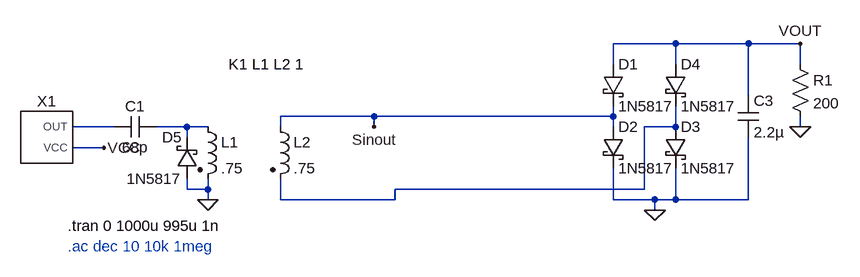
[diagram p0: schematic WPT.asc]
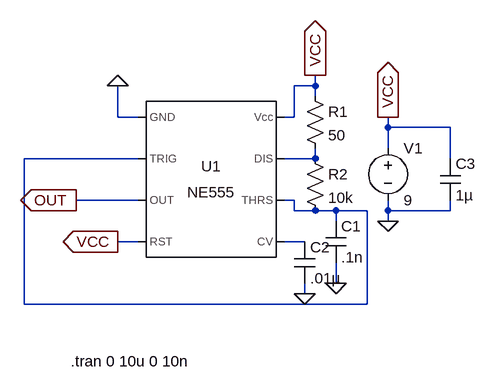
[diagram p1: sub-circuit 555timer.asc]
WPT.asc, the LTspice schematic file:
Version 4
SHEET 1 1428 680
WIRE 1008 0 912 0
WIRE 1120 0 1008 0
WIRE 1200 0 1120 0
WIRE 912 32 912 0
WIRE 1008 32 1008 0
WIRE 1200 32 1200 0
WIRE 1120 80 1120 0
WIRE 544 112 400 112
WIRE 912 112 912 96
WIRE 912 112 544 112
WIRE 144 128 80 128
WIRE 256 128 208 128
WIRE 288 128 256 128
WIRE 400 128 400 112
WIRE 544 128 544 112
WIRE 912 128 912 112
WIRE 1008 128 1008 96
WIRE 1008 128 960 128
WIRE 1200 128 1200 112
WIRE 256 144 256 128
WIRE 128 160 80 160
WIRE 256 224 256 208
WIRE 288 224 288 208
WIRE 288 224 256 224
WIRE 960 224 960 128
WIRE 960 224 576 224
WIRE 288 240 288 224
WIRE 400 240 400 208
WIRE 576 240 576 224
WIRE 576 240 400 240
WIRE 912 240 912 192
WIRE 976 240 912 240
WIRE 1008 240 1008 192
WIRE 1008 240 976 240
WIRE 1120 240 1120 144
WIRE 1120 240 1008 240
WIRE 976 256 976 240
FLAG 128 160 VCC
FLAG 288 240 0
FLAG 976 256 0
FLAG 1200 0 VOUT
FLAG 1200 128 0
FLAG 544 128 Sinout
SYMBOL 555Timer 32 144 R0
SYMATTR InstName X1
SYMBOL ind2 272 112 R0
SYMATTR InstName L1
SYMATTR Value .75
SYMATTR Type ind
SYMBOL ind2 384 112 R0
SYMATTR InstName L2
SYMATTR Value .75
SYMATTR Type ind
SYMBOL schottky 896 32 R0
SYMATTR InstName D1
SYMATTR Value 1N5817
SYMATTR Description Diode
SYMATTR Type diode
SYMBOL res 1184 16 R0
SYMATTR InstName R1
SYMATTR Value 200
SYMBOL cap 1104 80 R0
SYMATTR InstName C3
SYMATTR Value 2.2µ
SYMBOL schottky 896 128 R0
SYMATTR InstName D2
SYMATTR Value 1N5817
SYMATTR Description Diode
SYMATTR Type diode
SYMBOL schottky 992 128 R0
SYMATTR InstName D3
SYMATTR Value 1N5817
SYMATTR Description Diode
SYMATTR Type diode
SYMBOL schottky 992 32 R0
SYMATTR InstName D4
SYMATTR Value 1N5817
SYMATTR Description Diode
SYMATTR Type diode
SYMBOL schottky 272 208 R180
WINDOW 0 24 64 Left 2
WINDOW 3 24 0 Left 2
SYMATTR InstName D5
SYMATTR Value 1N5817
SYMATTR Description Diode
SYMATTR Type diode
SYMBOL cap 144 144 R270
WINDOW 0 32 32 VTop 2
WINDOW 3 0 32 VBottom 2
SYMATTR InstName C1
SYMATTR Value 68p
TEXT 72 280 Left 2 !.tran 0 1000u 995u 1n
TEXT 72 312 Left 2 ;.ac dec 10 10k 1meg
TEXT 320 32 Left 2 !K1 L1 L2 1

555timer.asc, the sub-circuit schematic file:
Version 4
SHEET 1 880 680
WIRE 544 -32 544 -48
WIRE 544 -32 512 -32
WIRE 544 -16 544 -32
WIRE 240 16 240 -32
WIRE 272 16 240 16
WIRE 512 16 512 -32
WIRE 512 16 496 16
WIRE 656 32 656 16
WIRE 752 32 656 32
WIRE 656 64 656 32
WIRE 272 80 96 80
WIRE 544 80 544 64
WIRE 544 80 496 80
WIRE 752 80 752 32
WIRE 272 144 176 144
WIRE 512 144 496 144
WIRE 512 160 512 144
WIRE 544 160 512 160
WIRE 576 160 544 160
WIRE 624 160 576 160
WIRE 656 160 656 144
WIRE 752 160 752 144
WIRE 752 160 656 160
WIRE 576 176 576 160
WIRE 656 176 656 160
WIRE 272 208 240 208
WIRE 528 208 496 208
WIRE 576 272 576 240
WIRE 528 288 528 272
WIRE 96 304 96 80
WIRE 624 304 624 160
WIRE 624 304 96 304
FLAG 656 176 0
FLAG 656 16 VCC
IOPIN 656 16 Out
FLAG 176 144 OUT
IOPIN 176 144 Out
FLAG 240 -32 0
FLAG 576 272 0
FLAG 240 208 VCC
IOPIN 240 208 Out
FLAG 544 -48 VCC
IOPIN 544 -48 Out
FLAG 528 288 0
SYMBOL voltage 656 48 R0
WINDOW 123 0 0 Left 0
WINDOW 39 0 0 Left 0
SYMATTR InstName V1
SYMATTR Value 9
SYMBOL res 528 -32 R0
SYMATTR InstName R1
SYMATTR Value 50
SYMBOL res 528 64 R0
SYMATTR InstName R2
SYMATTR Value 10k
SYMBOL cap 560 176 R0
SYMATTR InstName C1
SYMATTR Value .1n
SYMBOL cap 736 80 R0
SYMATTR Value 1µ
SYMATTR InstName C3
SYMATTR SpiceLine V=50 Irms=13m Rser=2.3363 Lser=3.377n mfg="Würth Elektronik" pn="860020672005 WCAP-ATG5 5x11" type="Al electrolytic"
SYMBOL Misc\\NE555 384 112 R0
SYMATTR InstName U1
SYMBOL cap 512 208 R0
SYMATTR InstName C2
SYMATTR Value .01µ
TEXT 168 392 Left 2 !.tran 0 10u 0 10n

The netlist it stands for:
* WPT.asc
XX1 N001 VCC 555timer
L1 N002 0 .75
L2 Sinout N003 .75
D1 VOUT Sinout 1N5817
R1 VOUT 0 200
C3 VOUT 0 2.2µ
D2 Sinout 0 1N5817
D3 N003 0 1N5817
D4 VOUT N003 1N5817
D5 0 N002 1N5817
C1 N001 N002 68p

* block symbol definitions
.subckt 555timer OUT VCC
V1 VCC 0 9
R1 VCC N002 50
R2 N002 N001 10k
C1 N001 0 .1n
C3 VCC 0 1µ V=50 Irms=13m Rser=2.3363 Lser=3.377n mfg="Würth Elektronik" pn="860020672005 WCAP-ATG5 5x11" type="Al electrolytic"
XU1 0 N001 OUT VCC N003 N001 N002 VCC NE555  ; pins GND TRIG OUT RST CV THRS DIS Vcc
C2 N003 0 .01µ
.tran 0 10u 0 10n
.ends 555timer

.model D D
.lib standard.dio
.tran 0 1000u 995u 1n
* .ac dec 10 10k 1meg
K1 L1 L2 1
.lib NE555.sub
.backanno
.end